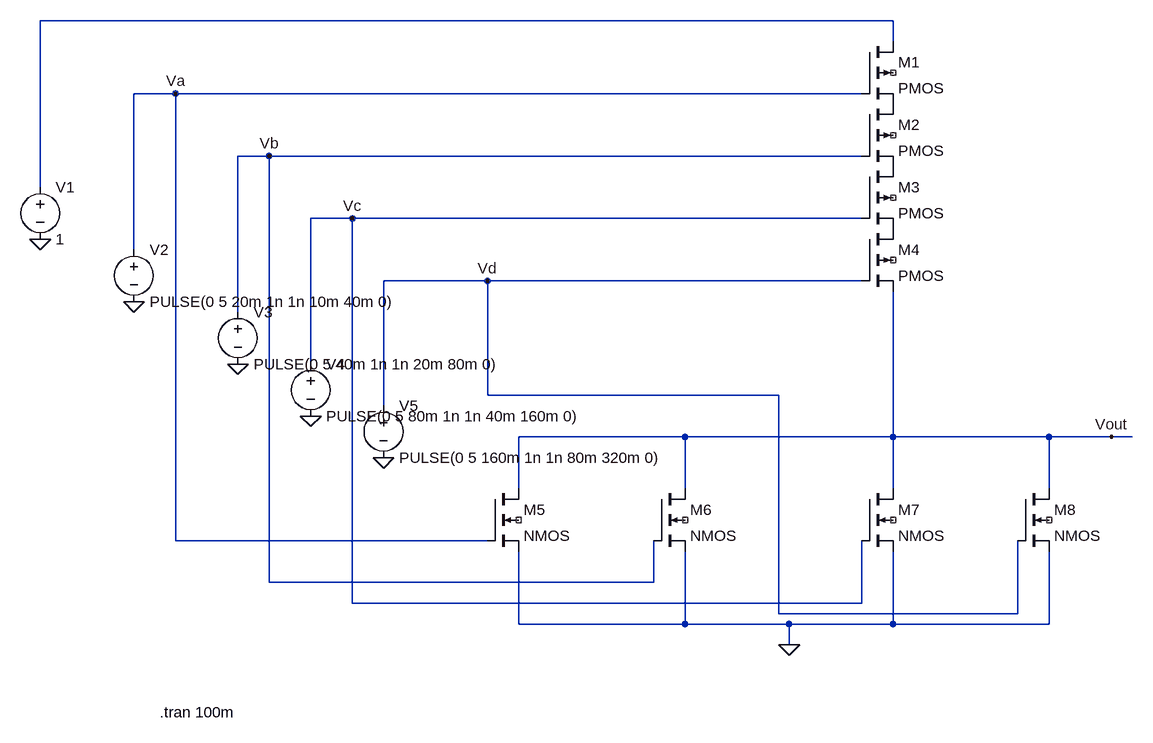
[diagram p0: schematic Draft2.asc]
Draft2.asc, the LTspice schematic file:
Version 4
SHEET 1 1136 1192
WIRE 640 112 -672 112
WIRE 640 144 640 112
WIRE -464 224 -528 224
WIRE 592 224 -464 224
WIRE -320 320 -368 320
WIRE 592 320 -320 320
WIRE -672 368 -672 112
WIRE -192 416 -256 416
WIRE 592 416 -192 416
WIRE -528 464 -528 224
WIRE 16 512 -144 512
WIRE 592 512 16 512
WIRE -368 560 -368 320
WIRE -256 640 -256 416
WIRE 16 688 16 512
WIRE 464 688 16 688
WIRE -144 704 -144 512
WIRE 320 752 64 752
WIRE 640 752 640 528
WIRE 640 752 320 752
WIRE 880 752 640 752
WIRE 976 752 880 752
WIRE 1008 752 976 752
WIRE 64 832 64 752
WIRE 320 832 320 752
WIRE 640 832 640 752
WIRE 880 832 880 752
WIRE -464 912 -464 224
WIRE 16 912 -464 912
WIRE -320 976 -320 320
WIRE 272 976 272 912
WIRE 272 976 -320 976
WIRE -192 1008 -192 416
WIRE 592 1008 592 912
WIRE 592 1008 -192 1008
WIRE 464 1024 464 688
WIRE 832 1024 832 912
WIRE 832 1024 464 1024
WIRE 64 1040 64 928
WIRE 320 1040 320 928
WIRE 320 1040 64 1040
WIRE 480 1040 320 1040
WIRE 640 1040 640 928
WIRE 640 1040 480 1040
WIRE 880 1040 880 928
WIRE 880 1040 640 1040
WIRE 480 1072 480 1040
FLAG 480 1072 0
FLAG -672 448 0
FLAG -528 544 0
FLAG -368 640 0
FLAG -256 720 0
FLAG -192 416 Vc
FLAG 16 512 Vd
FLAG -464 224 Va
FLAG -320 320 Vb
FLAG -144 784 0
FLAG 976 752 Vout
SYMBOL voltage -672 352 R0
SYMATTR InstName V1
SYMATTR Value 1
SYMBOL voltage -528 448 R0
WINDOW 123 0 0 Left 0
WINDOW 39 0 0 Left 0
SYMATTR InstName V2
SYMATTR Value PULSE(0 5 20m 1n 1n 10m 40m 0)
SYMBOL voltage -368 544 R0
WINDOW 123 0 0 Left 0
WINDOW 39 0 0 Left 0
SYMATTR InstName V3
SYMATTR Value PULSE(0 5 40m 1n 1n 20m 80m 0)
SYMBOL voltage -256 624 R0
WINDOW 123 0 0 Left 0
WINDOW 39 0 0 Left 0
SYMATTR InstName V4
SYMATTR Value PULSE(0 5 80m 1n 1n 40m 160m 0)
SYMBOL voltage -144 688 R0
WINDOW 123 0 0 Left 0
WINDOW 39 0 0 Left 0
SYMATTR InstName V5
SYMATTR Value PULSE(0 5 160m 1n 1n 80m 320m 0)
SYMBOL pmos4 592 144 R0
SYMATTR InstName M1
SYMATTR Value2 l=14nm w=0.07um
SYMBOL pmos4 592 240 R0
SYMATTR InstName M2
SYMATTR Value2 l=14nm w=1.4um
SYMBOL pmos4 592 336 R0
SYMATTR InstName M3
SYMATTR Value2 l=14nm w=1.4um
SYMBOL pmos4 592 432 R0
SYMATTR InstName M4
SYMATTR Value2 l=14nm w=1.4um
SYMBOL nmos4 16 832 R0
SYMATTR InstName M5
SYMATTR Value2 l=14nm w=42nm
SYMBOL nmos4 272 832 R0
SYMATTR InstName M6
SYMATTR Value2 l=14nm w=42nm
SYMBOL nmos4 592 832 R0
SYMATTR InstName M7
SYMATTR Value2 l=14nm w=42nm
SYMBOL nmos4 832 832 R0
SYMATTR InstName M8
SYMATTR Value2 l=14nm w=42nm
TEXT -488 1176 Left 2 !.tran 100m

The netlist it stands for:
* Draft2.asc
V1 N001 0 1
V2 Va 0 PULSE(0 5 20m 1n 1n 10m 40m 0)
V3 Vb 0 PULSE(0 5 40m 1n 1n 20m 80m 0)
V4 Vc 0 PULSE(0 5 80m 1n 1n 40m 160m 0)
V5 Vd 0 PULSE(0 5 160m 1n 1n 80m 320m 0)
M1 N001 Va P001 NC_01 PMOS l=14nm w=0.07um
M2 P001 Vb P002 NC_02 PMOS l=14nm w=1.4um
M3 P002 Vc P003 NC_03 PMOS l=14nm w=1.4um
M4 P003 Vd Vout NC_04 PMOS l=14nm w=1.4um
M5 Vout Va 0 NC_05 NMOS l=14nm w=42nm
M6 Vout Vb 0 NC_06 NMOS l=14nm w=42nm
M7 Vout Vc 0 NC_07 NMOS l=14nm w=42nm
M8 Vout Vd 0 NC_08 NMOS l=14nm w=42nm
.model NMOS NMOS
.model PMOS PMOS
.lib standard.mos
.tran 100m
.backanno
.end